# Altium schematic sheet [08]-FPGA_Bank_1_Interface.SchDoc
size A4
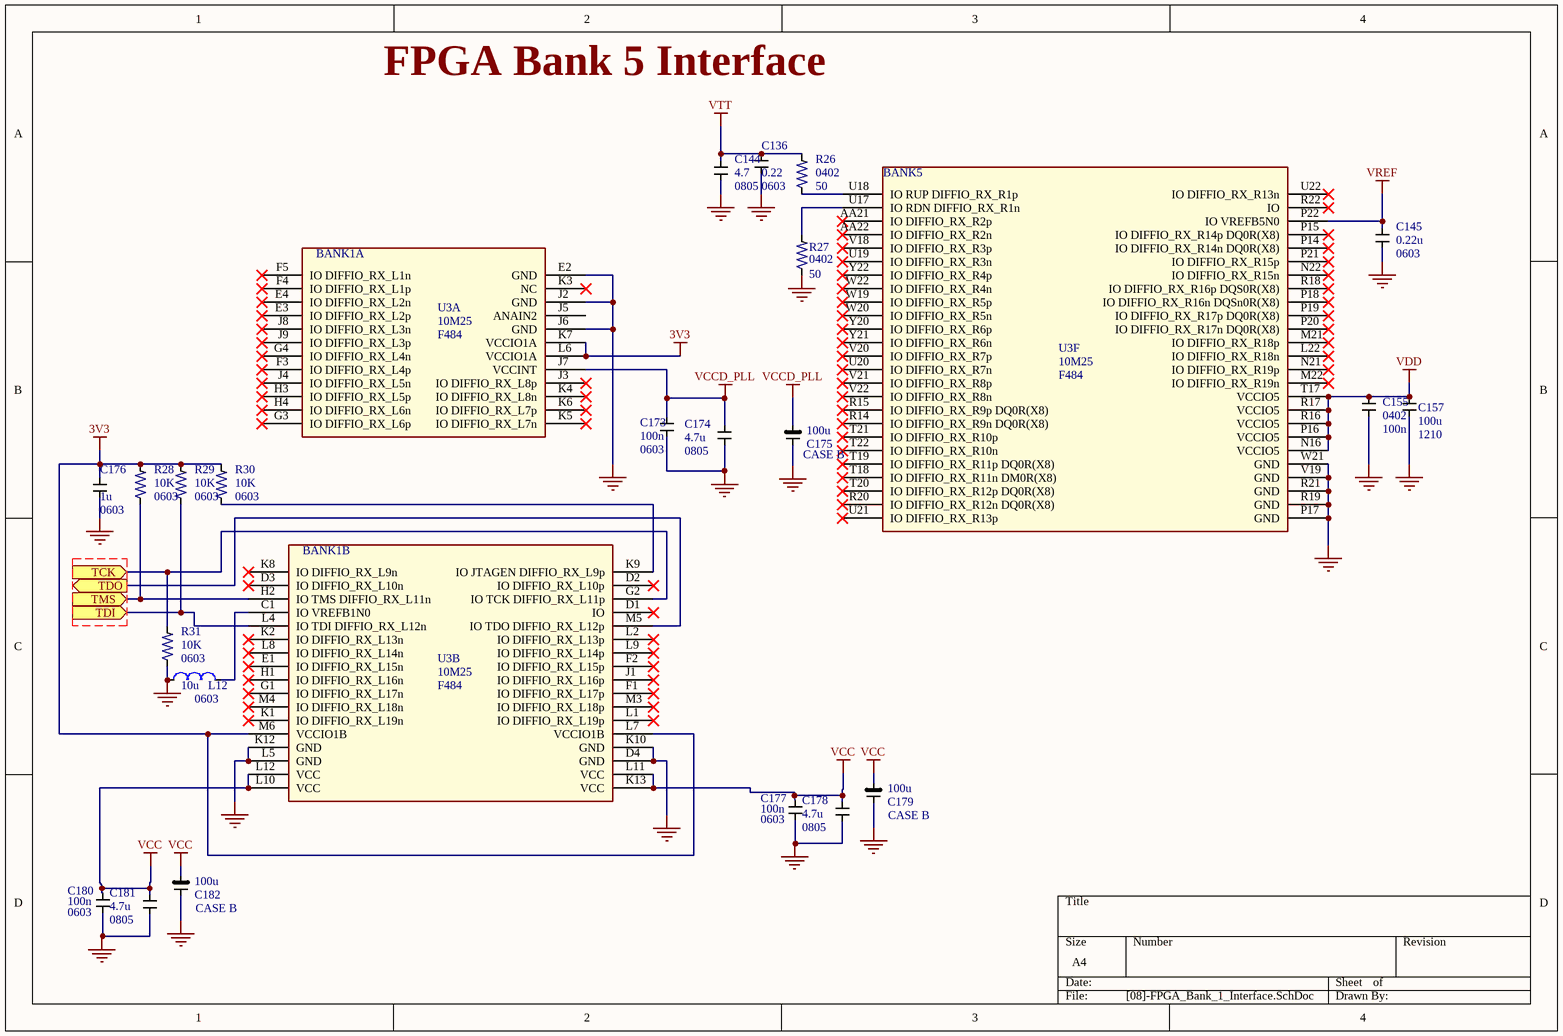
[diagram p0: [08]-FPGA_Bank_1_Interface.SchDoc]

## Parts
C136  0.22  PCB Layer:: 0603  [*0603]
C144  4.7  PCB Package: 0805  [*CAPC2013X140N]
C145  0.22u  PCB Layer:: 0603  [*0603]
C155  100n
C157  100u  PCB package type: 1210  [CAPC3225X28N]
C173  100n  PCB Layer:: 0603  [*0603]
C174  4.7u  PCB footprint: 0805
C175  100u  CASE: CASE B  [CAPC3529X21N]
C176  1u  PCB Layer:: 0603  [*0603]
C177  100n  PCB Layer:: 0603  [*0603]
C178  4.7u  PCB footprint: 0805
C179  100u  CASE: CASE B  [CAPC3529X21N]
C180  100n  PCB Layer:: 0603  [*0603]
C181  4.7u  PCB footprint: 0805
C182  100u  CASE: CASE B  [CAPC3529X21N]
L12  10u  PCB Layout:: 0603  [*INDC1608X95N]
R26  50  PCB footprint: 0402  [*R0402]
R27  50  PCB footprint: 0402  [*R0402]
R28  10K  foot print: 0603  [*0603]
R29  10K  foot print: 0603  [*0603]
R30  10K  foot print: 0603  [*0603]
R31  10K  foot print: 0603  [*0603]
U3  10M25  Package Type: F484  [*BGA484C100P22X22_2300X2300X200N]  (parts A,B,F of 9)

## Ports
TCK (in), TDI (in), TDO (out), TMS (in)

## Nets
3V3: C176.2 R28.2 R29.2 R30.2 U3.K7(VCCIO1A) U3.L6(VCCIO1A) U3.L7(VCCIO1B) U3.M6(VCCIO1B)
GND: C136.1 C144.1 C145.1 C155.1 C157.1 C173.1 C174.1 C175.2 C176.1 C177.1 C178.1 C179.2 C180.1 C181.1 C182.2 L12.1 R27.1 R31.1 U3.D4(GND) U3.E2(GND) U3.J2(GND) U3.J6(GND) U3.K10(GND) U3.K12(GND) U3.L5(GND) U3.P17(GND) U3.R19(GND) U3.R21(GND) U3.V19(GND) U3.W21(GND)
VCC: C177.2 C178.2 C179.1 C180.2 C181.2 C182.1 U3.K13(VCC) U3.L10(VCC) U3.L11(VCC) U3.L12(VCC)
VCCD_PLL: C173.2 C174.2 C175.1 U3.J7(VCCINT)
VDD: C155.2 C157.2 U3.N16(VCCIO5) U3.P16(VCCIO5) U3.R16(VCCIO5) U3.R17(VCCIO5) U3.T17(VCCIO5)
VREF: C145.2 U3.P22(IO_VREFB5N0)
VTT: C136.2 C144.2 R26.2
TCK: R31.2 U3.G2(IO_TCK_DIFFIO_RX_L11p) ; port TCK
TDI: R29.1 U3.L4(IO_TDI_DIFFIO_RX_L12n) ; port TDI
TDO: U3.M5(IO_TDO_DIFFIO_RX_L12p) ; port TDO
TMS: R28.1 U3.H2(IO_TMS_DIFFIO_RX_L11n) ; port TMS
NetL12_2: L12.2 U3.C1(IO_VREFB1N0)
NetR26_1: R26.1 U3.U18(IO_RUP_DIFFIO_RX_R1p)
NetR27_2: R27.2 U3.U17(IO_RDN_DIFFIO_RX_R1n)
NetR30_1: R30.1 U3.K9(IO_JTAGEN_DIFFIO_RX_L9p)

Not connected (* = marked no-connect by the designer): U3 AA21(IO_DIFFIO_RX_R2p)* AA22(IO_DIFFIO_RX_R2n)* D1(IO)* D2(IO_DIFFIO_RX_L10p)* D3(IO_DIFFIO_RX_L10n)* E1(IO_DIFFIO_RX_L15n)* E3(IO_DIFFIO_RX_L2p)* E4(IO_DIFFIO_RX_L2n)* F1(IO_DIFFIO_RX_L17p)* F2(IO_DIFFIO_RX_L15p)* F3(IO_DIFFIO_RX_L4p)* F4(IO_DIFFIO_RX_L1p)* F5(IO_DIFFIO_RX_L1n)* G1(IO_DIFFIO_RX_L17n)* G3(IO_DIFFIO_RX_L6p)* G4(IO_DIFFIO_RX_L4n)* H1(IO_DIFFIO_RX_L16n)* H3(IO_DIFFIO_RX_L5p)* H4(IO_DIFFIO_RX_L6n)* J1(IO_DIFFIO_RX_L16p)* J3(IO_DIFFIO_RX_L8p)* J4(IO_DIFFIO_RX_L5n)* J5(ANAIN2) J8(IO_DIFFIO_RX_L3n)* J9(IO_DIFFIO_RX_L3p)* K1(IO_DIFFIO_RX_L19n)* K2(IO_DIFFIO_RX_L13n)* K3(NC)* K4(IO_DIFFIO_RX_L8n)* K5(IO_DIFFIO_RX_L7n)* K6(IO_DIFFIO_RX_L7p)* K8(IO_DIFFIO_RX_L9n)* L1(IO_DIFFIO_RX_L19p)* L2(IO_DIFFIO_RX_L13p)* L8(IO_DIFFIO_RX_L14n)* L9(IO_DIFFIO_RX_L14p)* L22(IO_DIFFIO_RX_R18n)* M3(IO_DIFFIO_RX_L18p)* M4(IO_DIFFIO_RX_L18n)* M21(IO_DIFFIO_RX_R18p)* M22(IO_DIFFIO_RX_R19n)* N21(IO_DIFFIO_RX_R19p)* N22(IO_DIFFIO_RX_R15n)* P14(IO_DIFFIO_RX_R14n_DQ0R(X8))* P15(IO_DIFFIO_RX_R14p_DQ0R(X8))* P18(IO_DIFFIO_RX_R16n_DQSn0R(X8))* P19(IO_DIFFIO_RX_R17p_DQ0R(X8))* P20(IO_DIFFIO_RX_R17n_DQ0R(X8))* P21(IO_DIFFIO_RX_R15p)* R14(IO_DIFFIO_RX_R9n_DQ0R(X8))* R15(IO_DIFFIO_RX_R9p_DQ0R(X8))* R18(IO_DIFFIO_RX_R16p_DQS0R(X8))* R20(IO_DIFFIO_RX_R12n_DQ0R(X8))* R22(IO)* T18(IO_DIFFIO_RX_R11n_DM0R(X8))* T19(IO_DIFFIO_RX_R11p_DQ0R(X8))* T20(IO_DIFFIO_RX_R12p_DQ0R(X8))* T21(IO_DIFFIO_RX_R10p)* T22(IO_DIFFIO_RX_R10n)* U19(IO_DIFFIO_RX_R3n)* U20(IO_DIFFIO_RX_R7n)* U21(IO_DIFFIO_RX_R13p)* U22(IO_DIFFIO_RX_R13n)* V18(IO_DIFFIO_RX_R3p)* V20(IO_DIFFIO_RX_R7p)* V21(IO_DIFFIO_RX_R8p)* V22(IO_DIFFIO_RX_R8n)* W19(IO_DIFFIO_RX_R5p)* W20(IO_DIFFIO_RX_R5n)* W22(IO_DIFFIO_RX_R4n)* Y20(IO_DIFFIO_RX_R6p)* Y21(IO_DIFFIO_RX_R6n)* Y22(IO_DIFFIO_RX_R4p)*

## Notes on the sheet
- FPGA Bank 5 Interface
- (in symbol Component_1) 0402
- (in symbol Component_1, part A) BANK1A
- (in symbol Component_1, part B) BANK1B
- (in symbol Component_1, part F) BANK5

## Library data of the parts
C136 C144 C145 C155 C157 C173-C182 L12 = Component_1
  C136 C145 C173 C176 C177 C180: Buying URL:: https://uk.farnell.com/avx/0603yc105kat2a/cap-1-f-16v-10-x7r-0603/dp/1658870RL?st=1u%200603
  C144: Buying URL:: https://uk.farnell.com/avx/08053d475kat2a/cap-4-7-f-25v-10-x5r-0805/dp/1657932?st=4.7u%200805
  C155: Buying URL: https://uk.farnell.com/avx/04023c104kat2a/cap-0-1-f-25v-10-x7r-0402/dp/1867948?st=100n
  C174 C178 C181: Buying URL:: NEED TO BE ADDED
  C175 C179 C182: Buying URL:: https://uk.farnell.com/avx/tajb107k006tnj/cap-tant-aec-q200-100uf-6-3v-case/dp/2893386?st=100u%20CASE%20B
  L12: Buying URL:: https://uk.farnell.com/tdk/mlz1608m100wt/inductor-10uh-20-shielded/dp/2215635?st=10uH%200603
R26 R27 = RP73D1J76R8BTDG: Res Thin Film 0603 76.8 Ohm 0.1% 1/10W Â±15ppm/Â°C Molded SMD Paper T/R; Buying URL:: https://uk.farnell.com/yageo/rc0402fr-07100rl/res-100r-1-0-0625w-0402-thick/dp/9239111
R28-R31 = RP73D1J76R8BTDG: Res Thin Film 0603 76.8 Ohm 0.1% 1/10W Â±15ppm/Â°C Molded SMD Paper T/R; MF: TE Connectivity / Holsworthy; Design by: Faheem; Price: None; MP: RP73D1J76R8BTDG; Package: 0603 TE Connectivity / AMP; SnapEDA_Link: https://www.snapeda.com/parts/RP73D1J76R8BTDG/TE%20Connectivity%20/%20Holsworthy/view-part/?ref=snap; Value: *; Buying URL:: https://uk.farnell.com/vishay/crcw060347k0fkea/res-47k-1-0-1w-0603-thick-film/dp/1469811?st=47K%200603; Availability: Unavailable
U3 = Component_1: Part no.: 10M25DAF484I7G